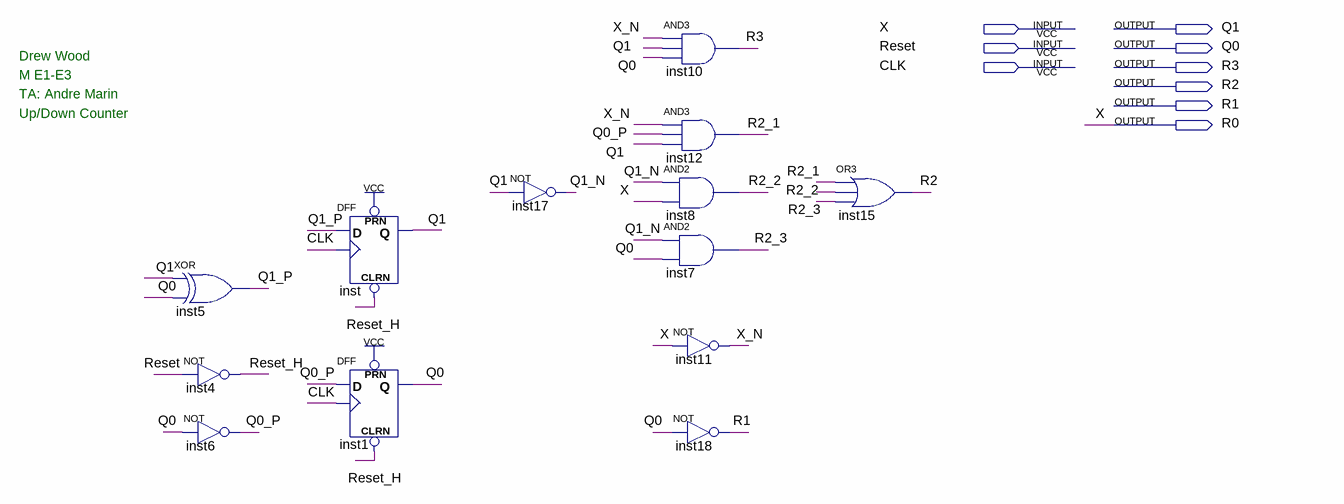
[diagram p0: schematic sheet]
// Quartus schematic lab7_part1.bdf as structural Verilog: 13 symbols, 9 pins
module lab7_part1 (
  input  X,
  input  Reset,
  input  CLK,
  output Q1,
  output Q0,
  output R3,
  output R2,
  output R1,
  output R0
);

  wire Q0_P, Q1_N, Q1_P, R2_1, R2_2, R2_3, Reset_H, X_N;

  xor inst5 (Q1_P, Q1, Q0);
  not inst4 (Reset_H, Reset);
  not inst6 (Q0_P, Q0);
  DFF inst (.CLRN(Reset_H), .CLK(CLK), .D(Q1_P), .PRN(1'b1), .Q(Q1));
  DFF inst1 (.CLRN(Reset_H), .CLK(CLK), .D(Q0_P), .PRN(1'b1), .Q(Q0));
  not inst17 (Q1_N, Q1);
  and inst10 (R3, X_N, Q1, Q0);
  and inst12 (R2_1, X_N, Q0_P, Q1);
  and inst8 (R2_2, Q1_N, X);
  and inst7 (R2_3, Q1_N, Q0);
  not inst11 (X_N, X);
  not inst18 (R1, Q0);
  or inst15 (R2, R2_1, R2_2, R2_3);

  assign R0 = X;

  // Notes on the sheet:
  //   Drew Wood
  //   M E1-E3
  //   TA: Andre Marin
  //   Up/Down Counter
endmodule
